# EasyEDA Pro project TJMakes_Radio_2.4GHz.eprj

# Schematic Schematic1
Create Date: 2024-02-22; Page Name: P1; Project Name: TJMakes_Radio_2.4GHz; Schematic Name: Schematic1; Update Date: 2024-02-22; Company: EasyEDA.com; Drawn: EasyEDA; Page Size: A4; Part Number: JLCPCB-002; Reviewed: EasyEDA; Version: V0.1
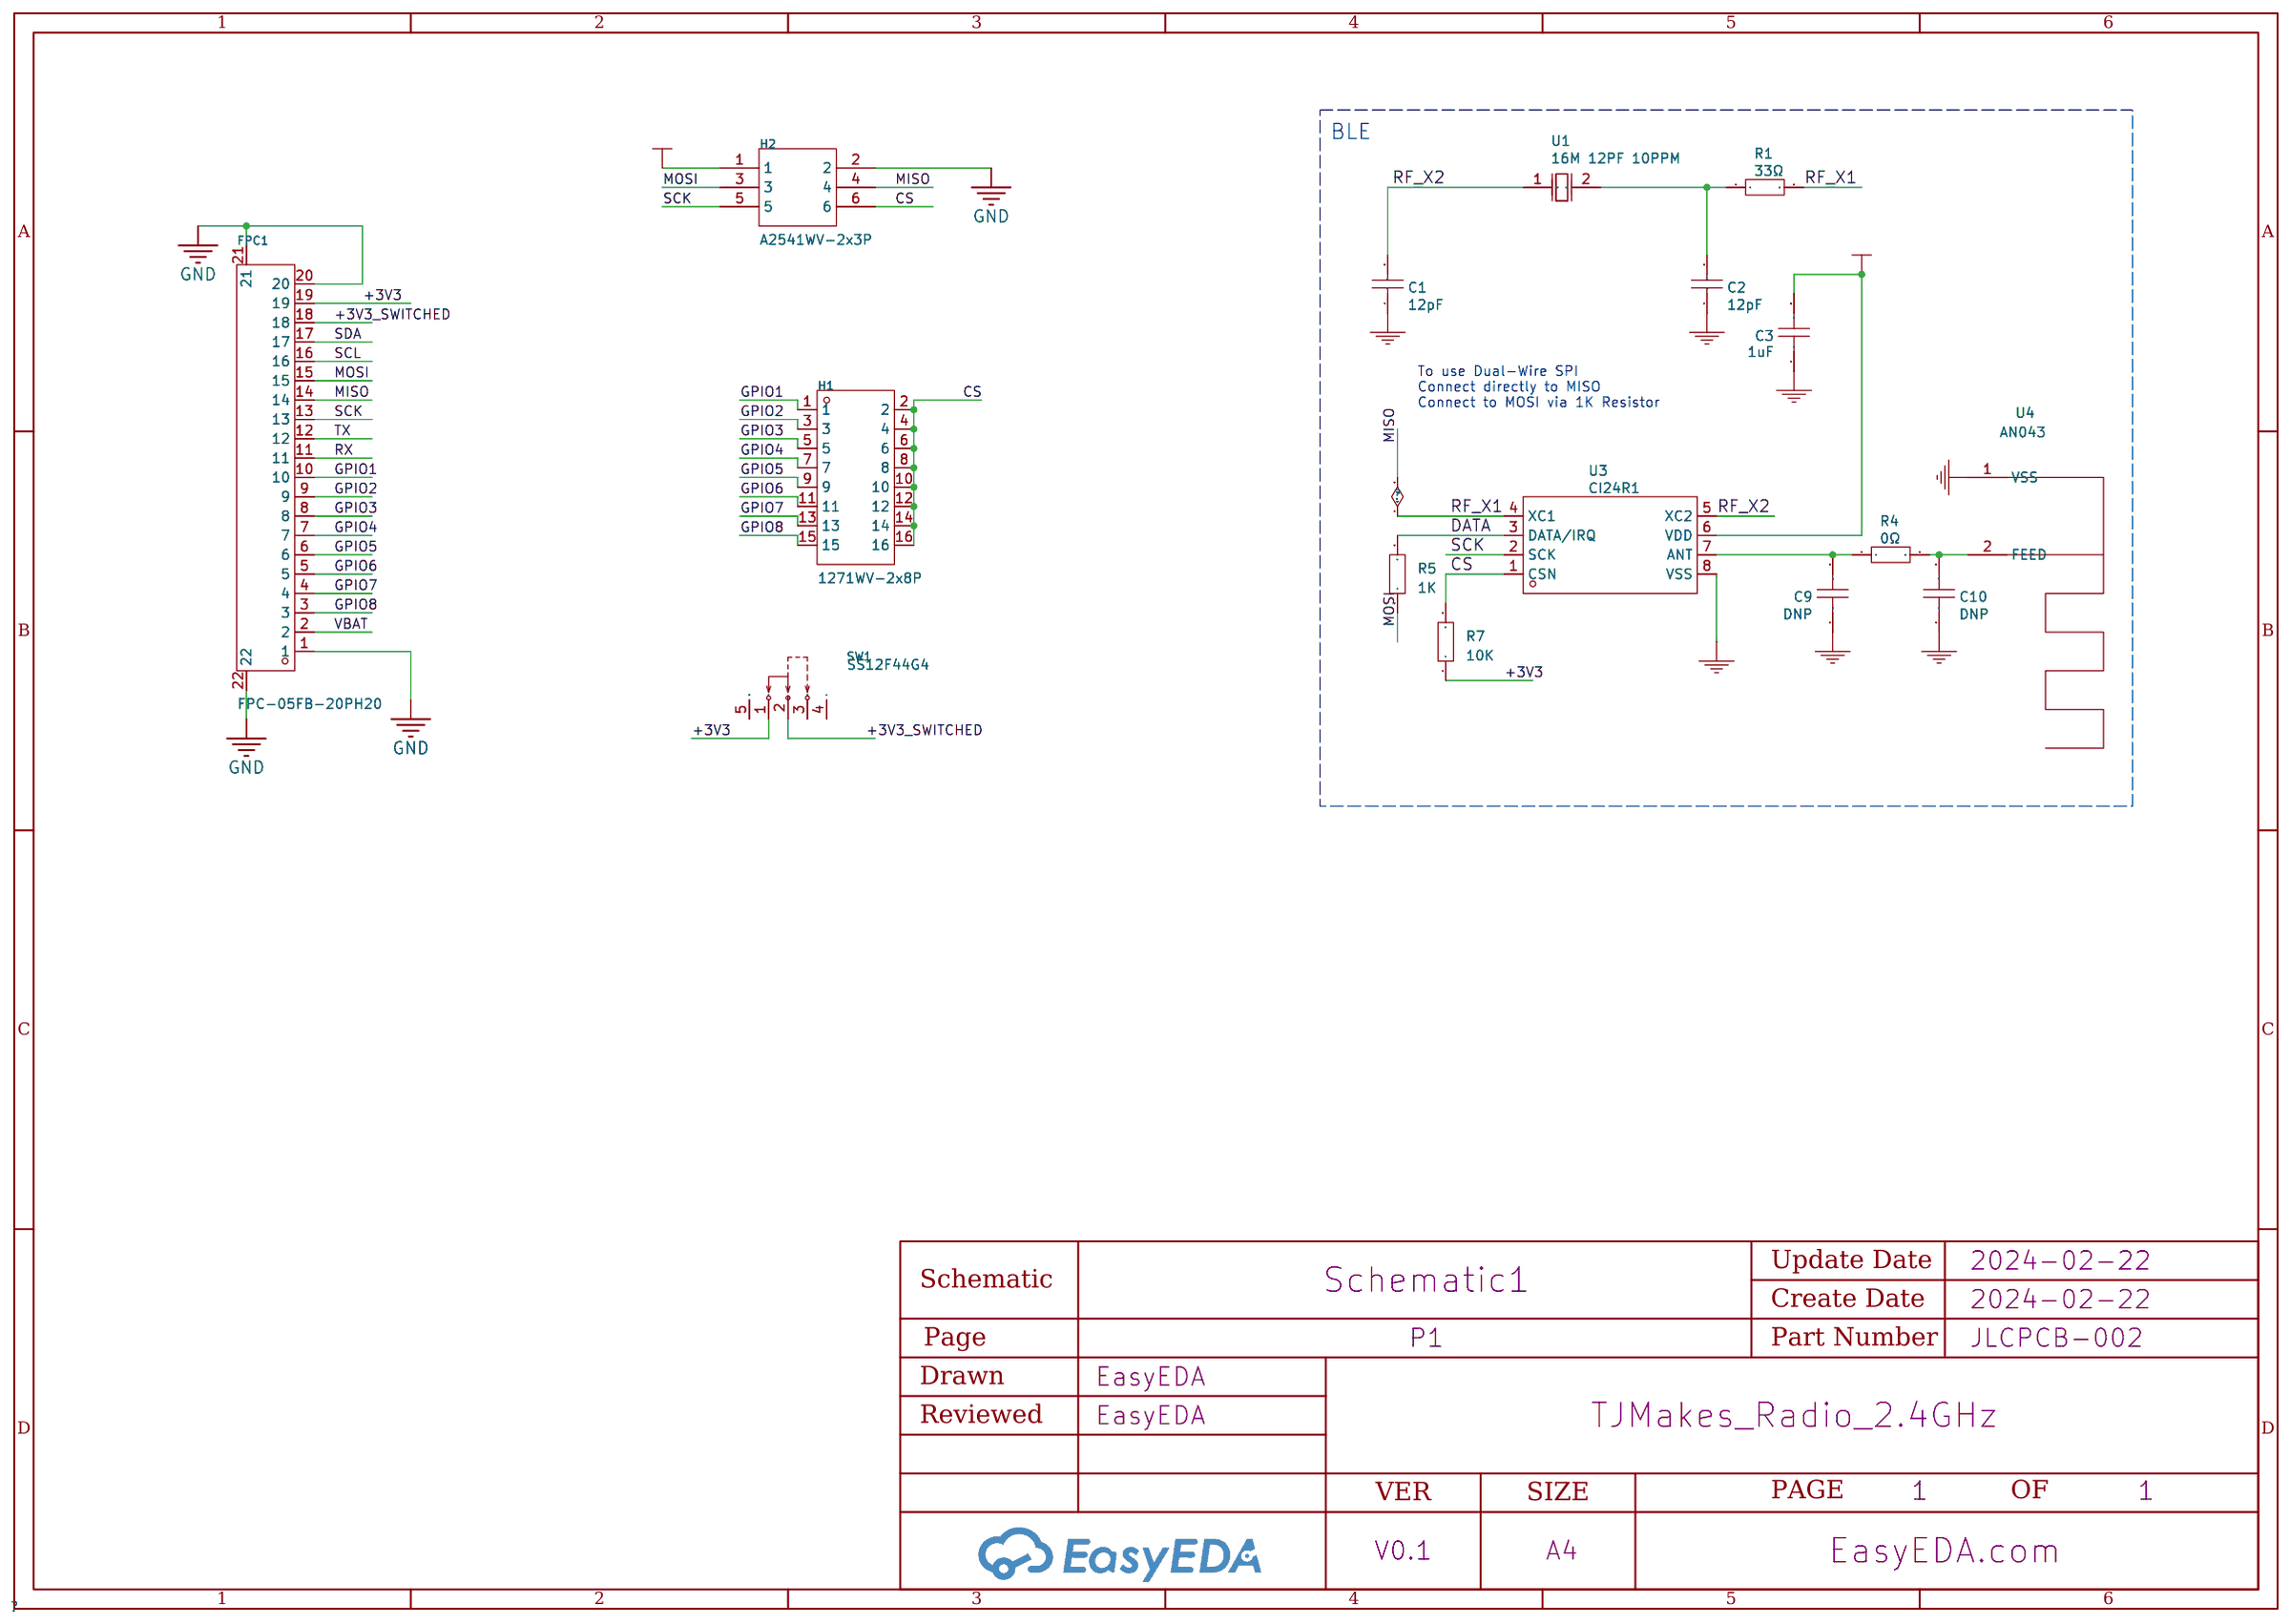
[diagram p0: schematic sheet]

## Parts
C1  12pF  [C0402]
C2  12pF  [C0402]
C3  1uF  [C0402]
C9  DNP  [C0402]
C10  DNP  [C0402]
FPC1  FPC-05FB-20PH20  [FPC-SMD_20P-P0.50_FPC-05FB-20PH20]
H1  1271WV-2x8P  [HDR-TH_16P-P1.27-V-M-R2-C8-S1.27]
H2  A2541WV-2x3P  [HDR-TH_6P-P2.54-V-R2-C3-S2.54_A2541WV-2X3P]
R1  33Ω  [R0402]
R4  0Ω  [R0402]
R5  1K  [R0402]
R7  10K  [R0603]
SW1  SS12F44G4  [SW-TH_SHOU-HAN_SS12F44G4]
U1  16M 12PF 10PPM  [HC-49S_L7.0-W4.0]
U3  CI24R1  [SOIC-8_L4.9-W3.9-P1.27-LS6.0-BL]
U4  AN043  [AN043]

## Library data of the parts
C1 C2 = 12pF: link: https://lcsc.com/eda_search?q=C106201&amp;%26type=1&amp;ref=editor; 3DModel: C0402_L1.0-W0.5-H0.5; Supplier: LCSC; Manufacturer: YAGEO(国巨); Manufacturer Part: CC0402JRNPO9BN120; Supplier Part: C106201; JLCPCB Part Class: Extended Part
C3 = 1uF: link: https://lcsc.com/eda_search?q=C2887020&amp;%26type=1&amp;ref=editor; 3DModel: C0402_L1.0-W0.5-H0.5; Supplier: LCSC; Supplier Part: C2887020; Manufacturer: CCTC(三环); Manufacturer Part: TCC0402X5R105M100AT; JLCPCB Part Class: Extended Part
C9 C10 = DNP: link: https://item.szlcsc.com/15869.html; 3DModel: C0402_L1.0-W0.5-H0.5
FPC1 = FPC-05FB-20PH20: Pitch:0.5mm Number of Contacts:20P Locking Feature:Clamshell FFC, FCB Thickness:0.3mm FFC, FCB Thickness:0.3mm Contact Type:Double-sided contacts/up and down connection Mounting Type:Surface Mount Height Above Board:2mm Operating Temperature Range:-25℃~+8; LCSC Part Name: 间距:0.5mm P数:20P 翻盖式 双侧触点/上下接; Supplier Part: C2856830; Manufacturer: XUNPU(讯普); Supplier Footprint: SMD,P=0.5mm,卧贴; JLCPCB Part Class: Extended Part; Datasheet: https://atta.szlcsc.com/upload/public/pdf/source/20210922/C2856830_32DC95BE77527398880E7D75F765EF2A.pdf; Supplier: LCSC; Pitch: 0.5mm; Number of Contacts: 20P; Locking Feature: Clamshell; FFC, FCB Thickness: 0.3mm; Contact Type: Double-sided contacts/up and down connection; Mounting Type: Surface Mount; Height Above Board: 2mm; Operating Temperature Range: -25℃~+85℃
H1 = KH-1.27PH180-2X8P-L7.2: Pin Structure:2x8P Pitch:1.27mm Row Spacing:1.27mm Circluar Pins/Square Pins:Square Pins Mounting Type:Straight Number of Rows:双排 Number of Pins:16P Current Rating (Max):1A Voltage Rating (Max):- Length of Mating Pin:3.9mm Insulation Height:1mm Length of; LCSC Part Name: 间距:1.27mm 2x8P 直插 方针; Supplier Part: C7470092; Manufacturer: kinghelm(金航标); Supplier Footprint: 插件,P=1.27mm; JLCPCB Part Class: Extended Part; Datasheet: https://atta.szlcsc.com/upload/public/pdf/source/20211228/40BBFCDE63818F8CDD890F8C15594070.pdf; Supplier: LCSC; Pin Structure: 2x8P; Pitch: 1.27mm; Row Spacing: 1.27mm; Circluar Pins/Square Pins: Square Pins; Mounting Type: Straight; Number of Rows: 双排; Number of Pins: 16P; Current Rating (Max): 1A; Length of Mating Pin: 3.9mm; Insulation Height: 1mm; Length of End Connection Pin: 2.3mm; Operating Temperature Range: -40℃~+105℃
H2 = A2541WV-2x3P: Pin Structure:2x3P Pitch:2.54mm Row Spacing:2.54mm Circluar Pins/Square Pins:Square Pins Mounting Type:Straight Number of Rows:双排 Number of Pins:6P Current Rating (Max):- Voltage Rating (Max):- Length of Mating Pin:6mm Insulation Height:2.54mm Length of E; LCSC Part Name: 间距:2.54mm 2x3P 直插 方针; Supplier Part: C225518; Manufacturer: CJT(长江连接器); Supplier Footprint: 插件,P=2.54mm; JLCPCB Part Class: Extended Part; Datasheet: https://atta.szlcsc.com/upload/public/pdf/source/20180724/C239359_48B1BC0CA1B4E4396A63955AAFD15564.pdf; Supplier: LCSC; Pin Structure: 2x3P; Pitch: 2.54mm; Row Spacing: 2.54mm; Circluar Pins/Square Pins: Square Pins; Mounting Type: Straight; Number of Rows: 双排; Number of Pins: 6P; Length of Mating Pin: 6mm; Insulation Height: 2.54mm; Length of End Connection Pin: 3mm; Operating Temperature Range: -40℃~+105℃; Color: Black
R1 = 33Ω: link: https://lcsc.com/eda_search?q=C25105&amp;%26type=1&amp;ref=editor; 3DModel: R0402_L1.0-W0.5-H0.5; Supplier: LCSC; Manufacturer: UNI-ROYAL(厚声); Manufacturer Part: 0402WGF330JTCE; Supplier Part: C25105; JLCPCB Part Class: Basic Part
R4 R5 = 0Ω: link: https://lcsc.com/eda_search?q=C21376&amp;%26type=1&amp;ref=editor; 3DModel: R0402_L1.0-W0.5-H0.5; Supplier: LCSC; Manufacturer: UNI-ROYAL(厚声); Manufacturer Part: 0402WGJ0000TCE; Supplier Part: C21376; JLCPCB Part Class: Extended Part
R7 = Res_0603: Supplier Footprint: 0603
SW1 = SS12F44G4: Circuit:SPDT Actuator Style:- Pin Style:PCPin Switch Length:12mm Switch Width:4.5mm Switch Height:6mm Mounting Style:Straight Actuator Color:- Current Rating (DC):300mA Voltage Rating (DC):50V Current Rating (AC):- Voltage Rating (AC):- Mechanical Life:5千; Supplier Part: C2887261; Manufacturer: SHOU HAN(首韩); Supplier Footprint: 插件; JLCPCB Part Class: Extended Part; Datasheet: https://atta.szlcsc.com/upload/public/pdf/source/20210820/C87A250874D550AF2167CED4FCF38A85.pdf; Supplier: LCSC; Circuit: SPDT; Pin Style: PCPin; Switch Length: 12mm; Switch Width: 4.5mm; Switch Height: 6mm; Mounting Style: Straight; Current Rating (DC): 300mA; Voltage Rating (DC): 50V; Mechanical Life: 5千次; Operating Temperature: -10℃~+50℃
U1 = 16M 12PF 10PPM: link: https://lcsc.com/eda_search?q=C2975359&amp;%26type=1&amp;ref=editor; Supplier: LCSC; Supplier Part: C2975359; Manufacturer: SST(索斯特)
U3 = CI24R1: 3DModel: SOIC-8_L4.9-W3.9-H1.7-LS6.0-P1.27; link: https://lcsc.com/eda_search?q=C2909832&amp;%26type=1&amp;ref=editor; Supplier: LCSC; Supplier Part: C2909832; Manufacturer: 南京中科微; Manufacturer Part: Ci24R1; JLCPCB Part Class: Extended Part
U4 = AN043: Manufacturer: Texas Instruments

## Nets
+3V3: FPC1.19 R7.1 SW1.1
+3V3_SWITCHED: C3.2 FPC1.18 H2.1 SW1.2 U3.6(VDD)
GND: C1.1 C2.1 C3.1 C9.1 C10.1 FPC1.1 FPC1.20 FPC1.21 FPC1.22 H2.2 U3.8(VSS) U4.1(VSS)
VBAT: FPC1.2
CS: H1.2 H1.4 H1.6 H1.8 H1.10 H1.12 H1.14 H1.16 H2.6 R7.2 U3.1(CSN)
DATA: R5.2 U3.3(DATA/IRQ)
GPIO1: FPC1.10 H1.1
GPIO2: FPC1.9 H1.3
GPIO3: FPC1.8 H1.5
GPIO4: FPC1.7 H1.7
GPIO5: FPC1.6 H1.9
GPIO6: FPC1.5 H1.11
GPIO7: FPC1.4 H1.13
GPIO8: FPC1.3 H1.15
MISO: FPC1.14 H2.4 R1.2 U3.4(XC1)
MOSI: FPC1.15 H2.3 R5.1
RF_X2: C1.2 U1.1(OSC1) U3.5(XC2)
RX: FPC1.11
SCK: FPC1.13 H2.5 U3.2(SCK)
SCL: FPC1.16
SDA: FPC1.17
TX: FPC1.12
$1N1240: C10.2 R4.2 U4.2(FEED)
$1N1241: C9.2 R4.1 U3.7(ANT)
$1N1246: C2.2 R1.1 U1.2(OSC2)

Not connected (* = marked no-connect by the designer): SW1 3 4 5

## Notes on the sheet
- BLE
- To use Dual-Wire SPI
  Connect directly to MISO
  Connect to MOSI via 1K Resistor

# Board PCB1
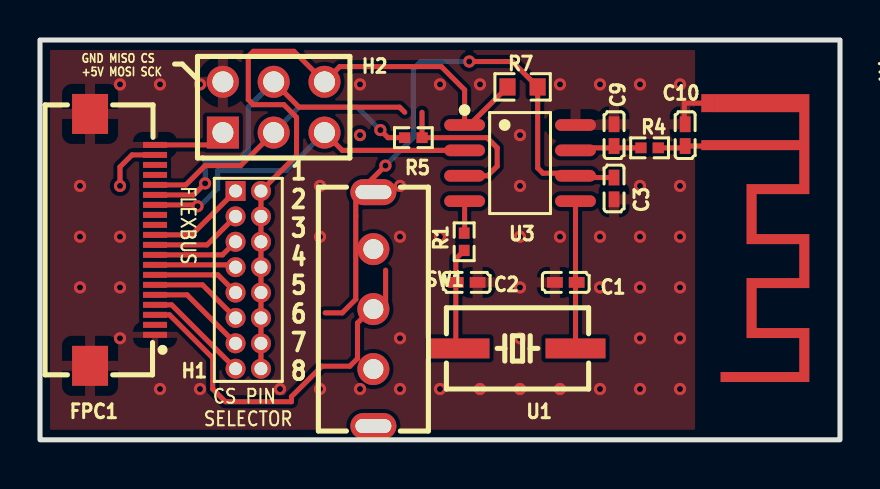
[diagram p1: board, top side]
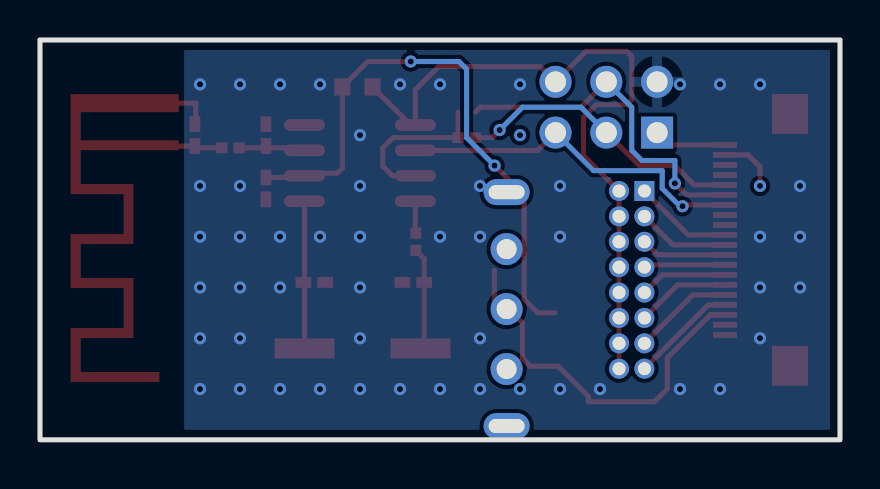
[diagram p2: board, bottom side, seen from below]

Outline 40 x 20 mm; copper layers: Top Layer, Bottom Layer. Coordinates in mm from the lower left corner of the outline.
Outline path: rectangle 0,20 40,0
Stack: Top Layer 0.035mm / Dielectric1 1.51mm FR4 er 4.5 / Bottom Layer 0.035mm

## Design rules (mm)
template: JLCPCB Capability(Two Layers Board)
spacing copperThickness1oz (default): track to track 0.102, other pairs 0.152 to 0.3
spacing copperThickness2oz: track to track 0.203, other pairs 0.152 to 0.3
track width copperThickness1oz (default): min 0.127, default 0.254, max 2.54
track width copperThickness2oz: min 0.203, default 0.254, max 2.54
differential pair differentialPair (default): width min 0.127, default 0.254, max 2.54; gap min 0.152, default 0.152
via viaSize (default): diameter min 0.5, default 0.61, max 10; hole min 0.3, default 0.305, max 6.3

## Placement (name value [footprint] x y rotation side)
C1  12pF  [C0402]  26.29 7.87 0 top
C2  12pF  [C0402]  21.34 7.87 180 top
C3  1uF  [C0402]  28.7 12.57 90 top
C9  DNP  [C0402]  28.7 15.24 270 top
C10  DNP  [C0402]  32.26 15.24 270 top
FPC1  FPC-05FB-20PH20  [FPC-SMD_20P-P0.50_FPC-05FB-20PH20]  4.13 10 270 top
H1  1271WV-2x8P  [HDR-TH_16P-P1.27-V-M-R2-C8-S1.27]  10.41 8 270 top
H2  A2541WV-2x3P  [HDR-TH_6P-P2.54-V-R2-C3-S2.54_A2541WV-2X3P]  11.68 16.64 0 top
R1  33Ω  [R0402]  21.21 9.91 90 top
R4  0Ω  [R0402]  30.48 14.61 0 top
R5  1K  [R0402]  18.67 15.11 0 top
R7  10K  [R0603]  24.13 17.65 180 top
SW1  SS12F44G4  [SW-TH_SHOU-HAN_SS12F44G4]  16.67 6.54 270 top
U1  16M 12PF 10PPM  [HC-49S_L7.0-W4.0]  23.88 4.57 180 top
U3  CI24R1  [SOIC-8_L4.9-W3.9-P1.27-LS6.0-BL]  24 13.84 270 top
U4  -  [AN043]  33.73 10 270 top

## Footprints (pads in the part's own frame, mm; a bottom-side part is the same pattern mirrored in y, then rotated)
AN043
  custom 0.9x0.665 smd: 1(-6.84,-0.33)
  custom 14.4x5.4 smd: 2(-0.09,3.17)
C0402
  rect 0.79x0.54 smd: 1(-0.545,0) 2(0.545,0)
FPC-SMD_20P-P0.50_FPC-05FB-20PH20
  rect 0.3x1.2 smd: 1(4.75,1.625) 2(4.25,1.625) 3(3.75,1.625) 4(3.25,1.625) 5(2.75,1.625) 6(2.25,1.625) 7(1.75,1.625) 8(1.25,1.625) 9(0.75,1.625) 10(0.25,1.625) 11(-0.25,1.625) 12(-0.75,1.625) 13(-1.25,1.625) 14(-1.75,1.625) 15(-2.25,1.625) 16(-2.75,1.625) 17(-3.25,1.625) 18(-3.75,1.625) 19(-4.25,1.625) 20(-4.75,1.625)
  rect 2x1.8 smd: 21(-6.3,-1.625) 22(6.3,-1.625)
HC-49S_L7.0-W4.0
  rect 3x1 smd: 1(-2.9,0) 2(2.9,0)
HDR-TH_6P-P2.54-V-R2-C3-S2.54_A2541WV-2X3P
  rect 1.6x1.6 hole 1.05: 1(-2.54,-1.27)
  round 1.6 hole 1.05: 2(-2.54,1.27) 3(0,-1.27) 4(0,1.27) 5(2.54,-1.27) 6(2.54,1.27)
HDR-TH_16P-P1.27-V-M-R2-C8-S1.27
  rect 1x1 hole 0.65: 1(-4.445,-0.635)
  round 1 hole 0.65: 2(-4.445,0.635) 3(-3.175,-0.635) 4(-3.175,0.635) 5(-1.905,-0.635) 6(-1.905,0.635) 7(-0.635,-0.635) 8(-0.635,0.635) 9(0.635,-0.635) 10(0.635,0.635) 11(1.905,-0.635) 12(1.905,0.635) 13(3.175,-0.635) 14(3.175,0.635) 15(4.445,-0.635) 16(4.445,0.635)
R0402
  rect 0.566x0.54 smd: 1(-0.433,0) 2(0.432,0)
R0603
  rect 0.806x0.864 smd: 1(-0.753,0) 2(0.753,0)
SOIC-8_L4.9-W3.9-P1.27-LS6.0-BL
  oval 0.588x2.045 smd: 1(-1.905,-2.772) 2(-0.635,-2.772) 3(0.635,-2.772) 4(1.905,-2.772) 5(1.905,2.772) 6(0.635,2.772) 7(-0.635,2.772) 8(-1.905,2.772)
SW-TH_SHOU-HAN_SS12F44G4
  round 1.6 hole 1: 1(-3,0) 2(0,0) 3(3,0)
  oval 1.3x2.3 hole 0.7x1.8: 4(5.85,0) 5(-5.85,0)

## Nets
As in the schematic.

Pads without a net: SW1 3 4 5

## Via types
v1: diameter 0.61, hole 0.304, Top Layer to Bottom Layer, 53 vias
v2: diameter 0.61, hole 0.305, Top Layer to Bottom Layer, 5 vias

## Routing (per net, layer and track width the routed paths; a pad name or vN(x,y) marks a point on that pad's centre or on a via; arc(x,y) is an arc through that point)
+3V3: length 29.5
  Top Layer w0.254: 28.7,13.12 26.87,13.12 26.78,13.21 26.65,13.33 25.15,13.33 24.88,13.6 R7.1 23.61,18.92 v2(21.46,18.92) ; 14.26,6.35 15.11,6.35 15.79,7.03 15.79,12.23 v2(17.27,13.72)
  Bottom Layer w0.254: v2(21.46,18.92) 19.05,18.92 18.67,18.54 18.67,15.11 v2(17.27,13.72)
+3V3_SWITCHED: length 3.6
  Top Layer w0.254: H2.1 8.53,14.75 5.75,14.75
+5V_SWITCHED: length 19.3
  Top Layer w0.254: 17.28,8.48 17.28,6.45 17.18,6.35 16.38,6.35 15.88,5.84 15.88,4.06 15.49,3.68 14.1,3.68 12.57,2.16 12.57,1.91 9.27,1.91 8.64,2.54 8.64,4.09 6.48,6.25 5.75,6.25
GND: length 5.2
  Top Layer w0.254: C10.1 32.21,15.83 32.21,16.84 U4.1 ; v1(4,12.7) 4,13.65 4.6,14.25 5.75,14.25
  vias: v1(2,12.7) v1(2,10.16) v1(2,7.62) v1(4,17.78) v1(4,10.16) v1(4,7.62) v1(4,5.08) v1(6,17.78) v1(6,2.54) v1(8,17.78) v1(8,2.54) v1(12,2.54) v1(14,12.7) v1(14,10.16) v1(14,2.54) v1(16,17.78) v1(16,2.54) v1(18,12.7) v1(18,10.16) v1(18,5.08) v1(18,2.54) v1(20,17.78) v1(20,10.16) v1(20,2.54) v1(22,17.78) v1(22,2.54) v1(24,15.24) v1(24,12.7) v1(24,10.16) v1(24,7.62) v1(24,5.08) v1(24,2.54) v1(26,17.78) v1(26,10.16) v1(26,2.54) v1(28,17.78) v1(28,10.16) v1(28,7.62) v1(28,2.54) v1(30,17.78) v1(30,12.7) v1(30,10.16) v1(30,7.62) v1(30,5.08) v1(30,2.54) v1(32,17.78) v1(32,12.7) v1(32,10.16) v1(32,7.62) v1(32,5.08) v1(32,2.54)
(no net):
  vias: v1(16,15.24)
CS: length 35.3
  Top Layer w0.254: H1.16 H1.14 H1.12 H1.10 H1.8 H1.6 H1.4 H1.2 12.83,14.22 12.83,16.13 12.19,16.76 10.67,16.76 10.41,17.02 10.41,19.18 10.67,19.43 12.7,19.43 H2.6 14.99,18.67 20.07,18.67 21.23,17.5 U3.1 21.47,15.75 R7.2
DATA: length 8
  Top Layer w0.254: 19.1,16.38 R5.2 22.35,15.11 22.86,14.61 22.86,13.69 22.38,13.21 U3.3
GPIO1: length 4.9
  Top Layer w0.254: 5.75,10.25 7.58,10.25 H1.1
GPIO2: length 4.6
  Top Layer w0.254: H1.3 8.35,9.75 5.75,9.75
GPIO3: length 4.3
  Top Layer w0.254: H1.5 9.12,9.25 5.75,9.25
GPIO4: length 4.1
  Top Layer w0.254: 5.75,8.75 9.67,8.75 H1.7
GPIO5: length 4.4
  Top Layer w0.254: H1.9 8.9,8.25 5.75,8.25
GPIO6: length 4.7
  Top Layer w0.254: 5.75,7.75 8.12,7.75 H1.11
GPIO7: length 5
  Top Layer w0.254: H1.13 7.36,7.25 5.75,7.25
GPIO8: length 5.3
  Top Layer w0.254: H1.15 6.59,6.75 5.75,6.75
MISO: length 19
  Top Layer w0.254: v2(8.25,12.83) 7.68,12.25 5.75,12.25 ; U3.4 21.23,10.36 R1.2 ; H2.4 12.95,16.64 17.98,16.64 18.24,16.38
  Bottom Layer w0.254: H2.4 10.41,16.64 10.41,14.48 9.91,13.97 8.25,13.97 v2(8.25,12.83)
MOSI: length 14.7
  Top Layer w0.254: 5.75,12.75 7.29,12.75 8.25,13.72 10.03,13.72 H2.3 ; v2(17.02,15.49) 17.4,15.11 R5.1
  Bottom Layer w0.254: v2(17.02,15.49) 15.88,16.64 12.95,16.64 H2.3
RF_X2: length 7.4
  Top Layer w0.254: U1.1 26.78,7.82 C1.2 26.78,7.93 U3.5
SCK: length 18.1
  Top Layer w0.254: U3.2 15.11,14.48 H2.5 ; 5.75,11.75 7.81,11.75 v2(7.87,11.68)
  Bottom Layer w0.254: H2.5 12.32,13.46 8.89,13.46 8.89,12.57 7.87,11.56 v2(7.87,11.68)
$1N1240: length 2.7
  Top Layer w0.254: 33.59,14.69 C10.2 32.17,14.61 R4.2
$1N1241: length 3.5
  Top Layer w0.254: U3.7 26.9,14.61 28.79,14.61 ; R4.1 28.79,14.61 ; 28.79,14.61 C9.2
$1N1246: length 5.2
  Top Layer w0.254: R1.1 20.79,9.06 C2.2 20.79,4.76 U1.2

## Copper pours and planes (outline as drawn; the poured copper is in the pictures)
GND on Top Layer: 0,20 32.75,20 32.75,0 0,0
GND on Bottom Layer: 0,20 32.8,20 32.8,0 0,0

## Text on the board
Top Silkscreen Layer: GND MISO CS / +5V MOSI SCK | CS PIN / SELECTOR | FLEXBUS | 1 / 2 / 3 / 4 / 5 / 6 / 7 / 8
